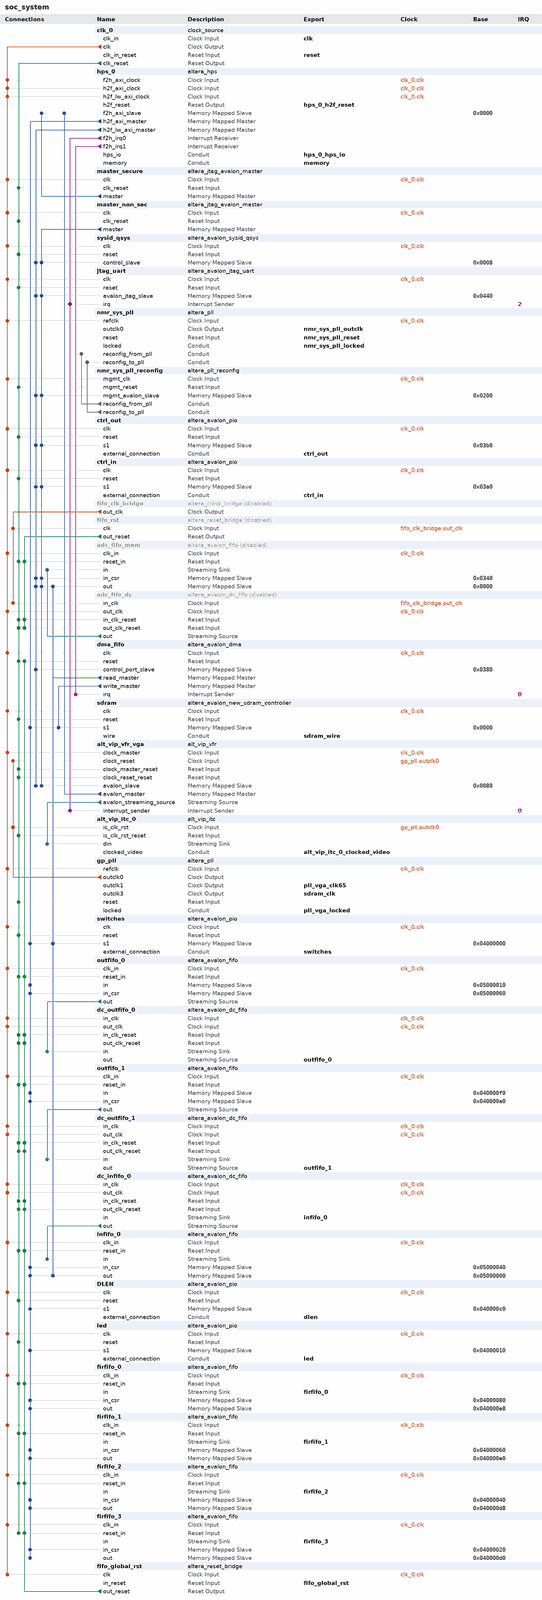
[diagram p0: system contents, whole]
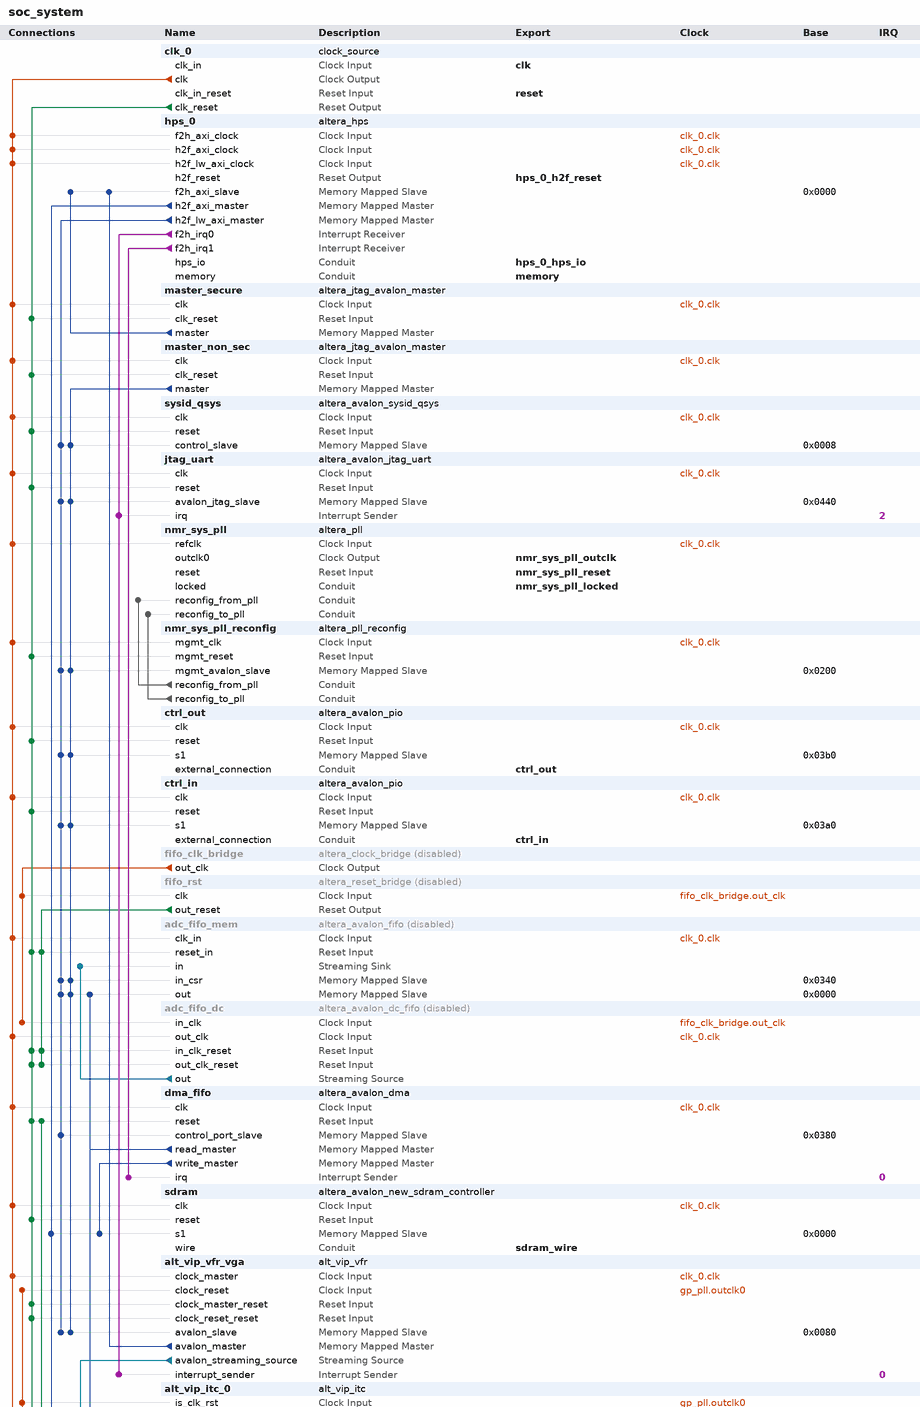
[diagram p1: system contents, upper part]
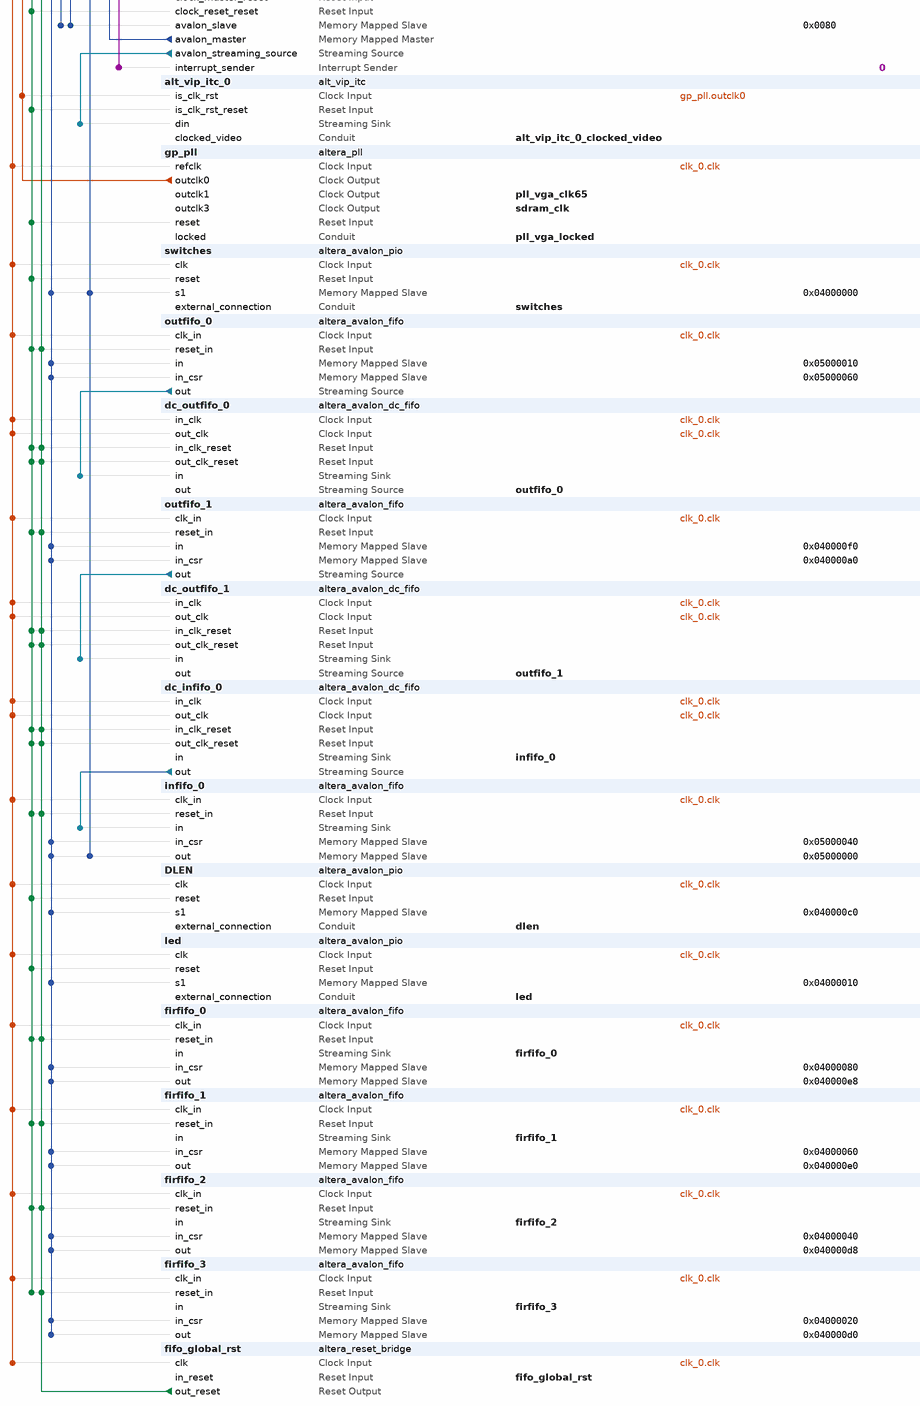
[diagram p2: system contents, lower part]
# Platform Designer (Qsys) system soc_system, Cyclone V 5CSEMA5F31C6
# Parameters at their usual value, and those the tool derives, are not listed.
package require -exact qsys 17.1
create_system soc_system
set_project_property DEVICE_FAMILY {Cyclone V}
set_project_property DEVICE 5CSEMA5F31C6

add_instance clk_0 clock_source 17.1
set_instance_parameter_value clk_0 clockFrequency 50000000

add_instance hps_0 altera_hps 17.1
set_instance_parameter_value hps_0 EMAC1_Mode RGMII
set_instance_parameter_value hps_0 EMAC1_PinMuxing {HPS I/O Set 0}
set_instance_parameter_value hps_0 F2SCLK_COLDRST_Enable false
set_instance_parameter_value hps_0 F2SCLK_DBGRST_Enable false
set_instance_parameter_value hps_0 F2SCLK_WARMRST_Enable false
set_instance_parameter_value hps_0 F2SINTERRUPT_Enable true
set_instance_parameter_value hps_0 F2S_Width 3
set_instance_parameter_value hps_0 FPGA_PERIPHERAL_OUTPUT_CLOCK_FREQ_EMAC0_GTX_CLK 100
set_instance_parameter_value hps_0 FPGA_PERIPHERAL_OUTPUT_CLOCK_FREQ_EMAC0_MD_CLK 100.0
set_instance_parameter_value hps_0 FPGA_PERIPHERAL_OUTPUT_CLOCK_FREQ_EMAC1_GTX_CLK 100
set_instance_parameter_value hps_0 FPGA_PERIPHERAL_OUTPUT_CLOCK_FREQ_EMAC1_MD_CLK 100.0
set_instance_parameter_value hps_0 HPS_PROTOCOL DDR3
set_instance_parameter_value hps_0 I2C0_Mode I2C
set_instance_parameter_value hps_0 I2C0_PinMuxing {HPS I/O Set 0}
set_instance_parameter_value hps_0 I2C1_Mode I2C
set_instance_parameter_value hps_0 I2C1_PinMuxing {HPS I/O Set 0}
set_instance_parameter_value hps_0 LWH2F_Enable true
set_instance_parameter_value hps_0 MEM_BANKADDR_WIDTH 3
set_instance_parameter_value hps_0 MEM_CLK_FREQ 400.0
set_instance_parameter_value hps_0 MEM_COL_ADDR_WIDTH 10
set_instance_parameter_value hps_0 MEM_DQ_WIDTH 32
set_instance_parameter_value hps_0 MEM_DRV_STR RZQ/7
set_instance_parameter_value hps_0 MEM_ROW_ADDR_WIDTH 15
set_instance_parameter_value hps_0 MEM_RTT_NOM RZQ/4
set_instance_parameter_value hps_0 MEM_RTT_WR RZQ/4
set_instance_parameter_value hps_0 MEM_TCL 11
set_instance_parameter_value hps_0 MEM_TFAW_NS 30.0
set_instance_parameter_value hps_0 MEM_TRAS_NS 35.0
set_instance_parameter_value hps_0 MEM_TRCD_NS 13.75
set_instance_parameter_value hps_0 MEM_TRFC_NS 260.0
set_instance_parameter_value hps_0 MEM_TRP_NS 13.75
set_instance_parameter_value hps_0 MEM_VENDOR JEDEC
set_instance_parameter_value hps_0 MEM_WTCL 8
set_instance_parameter_value hps_0 QSPI_Mode {1 SS}
set_instance_parameter_value hps_0 QSPI_PinMuxing {HPS I/O Set 0}
set_instance_parameter_value hps_0 REF_CLK_FREQ 25.0
set_instance_parameter_value hps_0 S2FCLK_USER2CLK 5
set_instance_parameter_value hps_0 S2F_Width 3
set_instance_parameter_value hps_0 SDIO_Mode {4-bit Data}
set_instance_parameter_value hps_0 SDIO_PinMuxing {HPS I/O Set 0}
set_instance_parameter_value hps_0 SPIM1_Mode {Single Slave Select}
set_instance_parameter_value hps_0 SPIM1_PinMuxing {HPS I/O Set 0}
set_instance_parameter_value hps_0 STM_Enable false
set_instance_parameter_value hps_0 TIMING_BOARD_AC_SKEW 0.03
set_instance_parameter_value hps_0 TIMING_BOARD_AC_TO_CK_SKEW 0.0
set_instance_parameter_value hps_0 TIMING_BOARD_DQ_TO_DQS_SKEW 0.0
set_instance_parameter_value hps_0 TIMING_BOARD_MAX_CK_DELAY 0.03
set_instance_parameter_value hps_0 TIMING_BOARD_MAX_DQS_DELAY 0.02
set_instance_parameter_value hps_0 TIMING_BOARD_SKEW_BETWEEN_DQS 0.08
set_instance_parameter_value hps_0 TIMING_BOARD_SKEW_CKDQS_DIMM_MAX 0.16
set_instance_parameter_value hps_0 TIMING_BOARD_SKEW_CKDQS_DIMM_MIN 0.09
set_instance_parameter_value hps_0 TIMING_BOARD_SKEW_WITHIN_DQS 0.01
set_instance_parameter_value hps_0 TIMING_TDH 65
set_instance_parameter_value hps_0 TIMING_TDQSCK 255
set_instance_parameter_value hps_0 TIMING_TDQSQ 125
set_instance_parameter_value hps_0 TIMING_TDS 30
set_instance_parameter_value hps_0 TIMING_TIH 140
set_instance_parameter_value hps_0 TIMING_TIS 180
set_instance_parameter_value hps_0 TIMING_TQSH 0.4
set_instance_parameter_value hps_0 UART0_Mode {No Flow Control}
set_instance_parameter_value hps_0 UART0_PinMuxing {HPS I/O Set 0}
set_instance_parameter_value hps_0 USB1_Mode SDR
set_instance_parameter_value hps_0 USB1_PinMuxing {HPS I/O Set 0}
set_instance_parameter_value hps_0 desired_cfg_clk_mhz 97.368421
set_instance_parameter_value hps_0 desired_qspi_clk_mhz 370.0

add_instance master_secure altera_jtag_avalon_master 17.1

add_instance master_non_sec altera_jtag_avalon_master 17.1

add_instance sysid_qsys altera_avalon_sysid_qsys 17.1
set_instance_parameter_value sysid_qsys id -1395322110

add_instance jtag_uart altera_avalon_jtag_uart 17.1
set_instance_parameter_value jtag_uart allowMultipleConnections true
set_instance_parameter_value jtag_uart simInteractiveOptions INTERACTIVE_ASCII_OUTPUT

add_instance nmr_sys_pll altera_pll 17.1
set_instance_parameter_value nmr_sys_pll gui_device_speed_grade 2
set_instance_parameter_value nmr_sys_pll gui_en_reconf true
set_instance_parameter_value nmr_sys_pll gui_number_of_clocks 1
set_instance_parameter_value nmr_sys_pll gui_operation_mode direct
set_instance_parameter_value nmr_sys_pll gui_output_clock_frequency0 120.0
set_instance_parameter_value nmr_sys_pll gui_pll_mode {Fractional-N PLL}
set_instance_parameter_value nmr_sys_pll gui_reference_clock_frequency 50.0
set_instance_parameter_value nmr_sys_pll gui_use_locked true

add_instance nmr_sys_pll_reconfig altera_pll_reconfig 17.1

add_instance ctrl_out altera_avalon_pio 17.1
set_instance_parameter_value ctrl_out direction Output
set_instance_parameter_value ctrl_out resetValue 119
set_instance_parameter_value ctrl_out width 32

add_instance ctrl_in altera_avalon_pio 17.1
set_instance_parameter_value ctrl_in direction Input
set_instance_parameter_value ctrl_in width 8

add_instance fifo_clk_bridge altera_clock_bridge 17.1
set_instance_property fifo_clk_bridge ENABLED false
set_instance_parameter_value fifo_clk_bridge DERIVED_CLOCK_RATE 0
set_instance_parameter_value fifo_clk_bridge EXPLICIT_CLOCK_RATE 0

add_instance fifo_rst altera_reset_bridge 17.1
set_instance_property fifo_rst ENABLED false
set_instance_parameter_value fifo_rst ACTIVE_LOW_RESET 0
set_instance_parameter_value fifo_rst SYNCHRONOUS_EDGES deassert

add_instance adc_fifo_mem altera_avalon_fifo 17.1
set_instance_property adc_fifo_mem ENABLED false
set_instance_parameter_value adc_fifo_mem bitsPerSymbol 32
set_instance_parameter_value adc_fifo_mem channelWidth 0
set_instance_parameter_value adc_fifo_mem errorWidth 0
set_instance_parameter_value adc_fifo_mem fifoDepth 1024
set_instance_parameter_value adc_fifo_mem fifoInputInterfaceOptions AVALONST_SINK
set_instance_parameter_value adc_fifo_mem fifoOutputInterfaceOptions AVALONMM_READ
set_instance_parameter_value adc_fifo_mem singleClockMode true
set_instance_parameter_value adc_fifo_mem symbolsPerBeat 1
set_instance_parameter_value adc_fifo_mem useIRQ false
set_instance_parameter_value adc_fifo_mem usePacket false
set_instance_parameter_value adc_fifo_mem useReadControl false

add_instance adc_fifo_dc altera_avalon_dc_fifo 17.1
set_instance_property adc_fifo_dc ENABLED false
set_instance_parameter_value adc_fifo_dc BITS_PER_SYMBOL 32
set_instance_parameter_value adc_fifo_dc FIFO_DEPTH 16384
set_instance_parameter_value adc_fifo_dc USE_PACKETS 0

add_instance dma_fifo altera_avalon_dma 17.1
set_instance_parameter_value dma_fifo allowByteTransactions false
set_instance_parameter_value dma_fifo allowDoubleWordTransactions false
set_instance_parameter_value dma_fifo allowHalfWordTransactions false
set_instance_parameter_value dma_fifo allowQuadWordTransactions false
set_instance_parameter_value dma_fifo burstEnable false
set_instance_parameter_value dma_fifo fifoDepth 1024
set_instance_parameter_value dma_fifo maxBurstSize 1024
set_instance_parameter_value dma_fifo minimumDmaTransactionRegisterWidth 32

add_instance sdram altera_avalon_new_sdram_controller 17.1
set_instance_parameter_value sdram TAC 5.4
set_instance_parameter_value sdram TRCD 15.0
set_instance_parameter_value sdram TRP 15.0
set_instance_parameter_value sdram casLatency 3
set_instance_parameter_value sdram columnWidth 10
set_instance_parameter_value sdram dataWidth 16
set_instance_parameter_value sdram generateSimulationModel true
set_instance_parameter_value sdram model single_Micron_MT48LC4M32B2_7_chip
set_instance_parameter_value sdram numberOfBanks 4
set_instance_parameter_value sdram numberOfChipSelects 1
set_instance_parameter_value sdram powerUpDelay 100.0
set_instance_parameter_value sdram refreshPeriod 7.8125
set_instance_parameter_value sdram rowWidth 13

add_instance alt_vip_vfr_vga alt_vip_vfr 14.0
set_instance_parameter_value alt_vip_vfr_vga MAX_IMAGE_WIDTH 1024

add_instance alt_vip_itc_0 alt_vip_itc 14.0
set_instance_parameter_value alt_vip_itc_0 FIFO_DEPTH 1920
set_instance_parameter_value alt_vip_itc_0 H_ACTIVE_PIXELS 1024
set_instance_parameter_value alt_vip_itc_0 H_BACK_PORCH 160
set_instance_parameter_value alt_vip_itc_0 H_FRONT_PORCH 24
set_instance_parameter_value alt_vip_itc_0 H_SYNC_LENGTH 136
set_instance_parameter_value alt_vip_itc_0 NUMBER_OF_COLOUR_PLANES 4
set_instance_parameter_value alt_vip_itc_0 THRESHOLD 1919
set_instance_parameter_value alt_vip_itc_0 V_ACTIVE_LINES 768
set_instance_parameter_value alt_vip_itc_0 V_BACK_PORCH 29
set_instance_parameter_value alt_vip_itc_0 V_FRONT_PORCH 3
set_instance_parameter_value alt_vip_itc_0 V_SYNC_LENGTH 6

add_instance gp_pll altera_pll 17.1
set_instance_parameter_value gp_pll gui_device_speed_grade 2
set_instance_parameter_value gp_pll gui_number_of_clocks 4
set_instance_parameter_value gp_pll gui_operation_mode normal
set_instance_parameter_value gp_pll gui_output_clock_frequency0 130.0
set_instance_parameter_value gp_pll gui_output_clock_frequency1 65.0
set_instance_parameter_value gp_pll gui_output_clock_frequency2 50.0
set_instance_parameter_value gp_pll gui_output_clock_frequency3 50.0
set_instance_parameter_value gp_pll gui_phase_shift3 -3800
set_instance_parameter_value gp_pll gui_pll_mode {Integer-N PLL}
set_instance_parameter_value gp_pll gui_reference_clock_frequency 50.0
set_instance_parameter_value gp_pll gui_use_locked true

add_instance switches altera_avalon_pio 17.1
set_instance_parameter_value switches direction Input
set_instance_parameter_value switches simDoTestBenchWiring true
set_instance_parameter_value switches width 10

add_instance outfifo_0 altera_avalon_fifo 17.1
set_instance_parameter_value outfifo_0 avalonMMAvalonMMDataWidth 64
set_instance_parameter_value outfifo_0 bitsPerSymbol 32
set_instance_parameter_value outfifo_0 channelWidth 0
set_instance_parameter_value outfifo_0 errorWidth 0
set_instance_parameter_value outfifo_0 fifoDepth 4096
set_instance_parameter_value outfifo_0 fifoInputInterfaceOptions AVALONMM_WRITE
set_instance_parameter_value outfifo_0 fifoOutputInterfaceOptions AVALONST_SOURCE
set_instance_parameter_value outfifo_0 singleClockMode true
set_instance_parameter_value outfifo_0 symbolsPerBeat 1
set_instance_parameter_value outfifo_0 useIRQ false
set_instance_parameter_value outfifo_0 usePacket false
set_instance_parameter_value outfifo_0 useReadControl false

add_instance dc_outfifo_0 altera_avalon_dc_fifo 17.1
set_instance_parameter_value dc_outfifo_0 BITS_PER_SYMBOL 32
set_instance_parameter_value dc_outfifo_0 FIFO_DEPTH 16384
set_instance_parameter_value dc_outfifo_0 USE_PACKETS 0

add_instance outfifo_1 altera_avalon_fifo 17.1
set_instance_parameter_value outfifo_1 avalonMMAvalonMMDataWidth 64
set_instance_parameter_value outfifo_1 bitsPerSymbol 32
set_instance_parameter_value outfifo_1 channelWidth 0
set_instance_parameter_value outfifo_1 errorWidth 0
set_instance_parameter_value outfifo_1 fifoDepth 4096
set_instance_parameter_value outfifo_1 fifoInputInterfaceOptions AVALONMM_WRITE
set_instance_parameter_value outfifo_1 fifoOutputInterfaceOptions AVALONST_SOURCE
set_instance_parameter_value outfifo_1 singleClockMode true
set_instance_parameter_value outfifo_1 symbolsPerBeat 1
set_instance_parameter_value outfifo_1 useIRQ false
set_instance_parameter_value outfifo_1 usePacket false
set_instance_parameter_value outfifo_1 useReadControl false

add_instance dc_outfifo_1 altera_avalon_dc_fifo 17.1
set_instance_parameter_value dc_outfifo_1 BITS_PER_SYMBOL 32
set_instance_parameter_value dc_outfifo_1 FIFO_DEPTH 16384
set_instance_parameter_value dc_outfifo_1 USE_PACKETS 0

add_instance dc_infifo_0 altera_avalon_dc_fifo 17.1
set_instance_parameter_value dc_infifo_0 BITS_PER_SYMBOL 32
set_instance_parameter_value dc_infifo_0 FIFO_DEPTH 16384
set_instance_parameter_value dc_infifo_0 USE_PACKETS 0

add_instance infifo_0 altera_avalon_fifo 17.1
set_instance_parameter_value infifo_0 avalonMMAvalonMMDataWidth 64
set_instance_parameter_value infifo_0 bitsPerSymbol 32
set_instance_parameter_value infifo_0 channelWidth 0
set_instance_parameter_value infifo_0 errorWidth 0
set_instance_parameter_value infifo_0 fifoDepth 8192
set_instance_parameter_value infifo_0 fifoInputInterfaceOptions AVALONST_SINK
set_instance_parameter_value infifo_0 fifoOutputInterfaceOptions AVALONMM_READ
set_instance_parameter_value infifo_0 singleClockMode true
set_instance_parameter_value infifo_0 symbolsPerBeat 1
set_instance_parameter_value infifo_0 useIRQ false
set_instance_parameter_value infifo_0 usePacket false
set_instance_parameter_value infifo_0 useReadControl false

add_instance DLEN altera_avalon_pio 17.1
set_instance_parameter_value DLEN direction Output
set_instance_parameter_value DLEN width 32

add_instance led altera_avalon_pio 17.1
set_instance_parameter_value led direction Output
set_instance_parameter_value led simDoTestBenchWiring true
set_instance_parameter_value led width 10

add_instance firfifo_0 altera_avalon_fifo 17.1
set_instance_parameter_value firfifo_0 avalonMMAvalonMMDataWidth 64
set_instance_parameter_value firfifo_0 bitsPerSymbol 32
set_instance_parameter_value firfifo_0 channelWidth 0
set_instance_parameter_value firfifo_0 errorWidth 0
set_instance_parameter_value firfifo_0 fifoDepth 8192
set_instance_parameter_value firfifo_0 fifoInputInterfaceOptions AVALONST_SINK
set_instance_parameter_value firfifo_0 fifoOutputInterfaceOptions AVALONMM_READ
set_instance_parameter_value firfifo_0 singleClockMode true
set_instance_parameter_value firfifo_0 symbolsPerBeat 1
set_instance_parameter_value firfifo_0 useBackpressure false
set_instance_parameter_value firfifo_0 useIRQ false
set_instance_parameter_value firfifo_0 usePacket false
set_instance_parameter_value firfifo_0 useReadControl false

add_instance firfifo_1 altera_avalon_fifo 17.1
set_instance_parameter_value firfifo_1 avalonMMAvalonMMDataWidth 64
set_instance_parameter_value firfifo_1 bitsPerSymbol 32
set_instance_parameter_value firfifo_1 channelWidth 0
set_instance_parameter_value firfifo_1 errorWidth 0
set_instance_parameter_value firfifo_1 fifoDepth 8192
set_instance_parameter_value firfifo_1 fifoInputInterfaceOptions AVALONST_SINK
set_instance_parameter_value firfifo_1 fifoOutputInterfaceOptions AVALONMM_READ
set_instance_parameter_value firfifo_1 singleClockMode true
set_instance_parameter_value firfifo_1 symbolsPerBeat 1
set_instance_parameter_value firfifo_1 useBackpressure false
set_instance_parameter_value firfifo_1 useIRQ false
set_instance_parameter_value firfifo_1 usePacket false
set_instance_parameter_value firfifo_1 useReadControl false

add_instance firfifo_2 altera_avalon_fifo 17.1
set_instance_parameter_value firfifo_2 avalonMMAvalonMMDataWidth 64
set_instance_parameter_value firfifo_2 bitsPerSymbol 32
set_instance_parameter_value firfifo_2 channelWidth 0
set_instance_parameter_value firfifo_2 errorWidth 0
set_instance_parameter_value firfifo_2 fifoDepth 8192
set_instance_parameter_value firfifo_2 fifoInputInterfaceOptions AVALONST_SINK
set_instance_parameter_value firfifo_2 fifoOutputInterfaceOptions AVALONMM_READ
set_instance_parameter_value firfifo_2 singleClockMode true
set_instance_parameter_value firfifo_2 symbolsPerBeat 1
set_instance_parameter_value firfifo_2 useBackpressure false
set_instance_parameter_value firfifo_2 useIRQ false
set_instance_parameter_value firfifo_2 usePacket false
set_instance_parameter_value firfifo_2 useReadControl false

add_instance firfifo_3 altera_avalon_fifo 17.1
set_instance_parameter_value firfifo_3 avalonMMAvalonMMDataWidth 64
set_instance_parameter_value firfifo_3 bitsPerSymbol 32
set_instance_parameter_value firfifo_3 channelWidth 0
set_instance_parameter_value firfifo_3 errorWidth 0
set_instance_parameter_value firfifo_3 fifoDepth 8192
set_instance_parameter_value firfifo_3 fifoInputInterfaceOptions AVALONST_SINK
set_instance_parameter_value firfifo_3 fifoOutputInterfaceOptions AVALONMM_READ
set_instance_parameter_value firfifo_3 singleClockMode true
set_instance_parameter_value firfifo_3 symbolsPerBeat 1
set_instance_parameter_value firfifo_3 useBackpressure false
set_instance_parameter_value firfifo_3 useIRQ false
set_instance_parameter_value firfifo_3 usePacket false
set_instance_parameter_value firfifo_3 useReadControl false

add_instance fifo_global_rst altera_reset_bridge 17.1
set_instance_parameter_value fifo_global_rst ACTIVE_LOW_RESET 0
set_instance_parameter_value fifo_global_rst SYNCHRONOUS_EDGES deassert

# connections
add_connection clk_0.clk adc_fifo_dc.out_clk clock
add_connection clk_0.clk adc_fifo_mem.clk_in clock
add_connection clk_0.clk alt_vip_vfr_vga.clock_master clock
add_connection clk_0.clk ctrl_in.clk clock
add_connection clk_0.clk ctrl_out.clk clock
add_connection clk_0.clk dc_infifo_0.in_clk clock
add_connection clk_0.clk dc_infifo_0.out_clk clock
add_connection clk_0.clk dc_outfifo_0.in_clk clock
add_connection clk_0.clk dc_outfifo_0.out_clk clock
add_connection clk_0.clk dc_outfifo_1.in_clk clock
add_connection clk_0.clk dc_outfifo_1.out_clk clock
add_connection clk_0.clk DLEN.clk clock
add_connection clk_0.clk dma_fifo.clk clock
add_connection clk_0.clk fifo_global_rst.clk clock
add_connection clk_0.clk firfifo_0.clk_in clock
add_connection clk_0.clk firfifo_1.clk_in clock
add_connection clk_0.clk firfifo_2.clk_in clock
add_connection clk_0.clk firfifo_3.clk_in clock
add_connection clk_0.clk gp_pll.refclk clock
add_connection clk_0.clk hps_0.f2h_axi_clock clock
add_connection clk_0.clk hps_0.h2f_axi_clock clock
add_connection clk_0.clk hps_0.h2f_lw_axi_clock clock
add_connection clk_0.clk infifo_0.clk_in clock
add_connection clk_0.clk jtag_uart.clk clock
add_connection clk_0.clk led.clk clock
add_connection clk_0.clk master_non_sec.clk clock
add_connection clk_0.clk master_secure.clk clock
add_connection clk_0.clk nmr_sys_pll.refclk clock
add_connection clk_0.clk nmr_sys_pll_reconfig.mgmt_clk clock
add_connection clk_0.clk outfifo_0.clk_in clock
add_connection clk_0.clk outfifo_1.clk_in clock
add_connection clk_0.clk sdram.clk clock
add_connection clk_0.clk switches.clk clock
add_connection clk_0.clk sysid_qsys.clk clock
add_connection fifo_clk_bridge.out_clk adc_fifo_dc.in_clk clock
add_connection fifo_clk_bridge.out_clk fifo_rst.clk clock
add_connection gp_pll.outclk0 alt_vip_itc_0.is_clk_rst clock
add_connection gp_pll.outclk0 alt_vip_vfr_vga.clock_reset clock
add_connection clk_0.clk_reset adc_fifo_dc.in_clk_reset reset
add_connection clk_0.clk_reset adc_fifo_dc.out_clk_reset reset
add_connection clk_0.clk_reset adc_fifo_mem.reset_in reset
add_connection clk_0.clk_reset alt_vip_itc_0.is_clk_rst_reset reset
add_connection clk_0.clk_reset alt_vip_vfr_vga.clock_master_reset reset
add_connection clk_0.clk_reset alt_vip_vfr_vga.clock_reset_reset reset
add_connection clk_0.clk_reset ctrl_in.reset reset
add_connection clk_0.clk_reset ctrl_out.reset reset
add_connection clk_0.clk_reset dc_infifo_0.in_clk_reset reset
add_connection clk_0.clk_reset dc_infifo_0.out_clk_reset reset
add_connection clk_0.clk_reset dc_outfifo_0.in_clk_reset reset
add_connection clk_0.clk_reset dc_outfifo_0.out_clk_reset reset
add_connection clk_0.clk_reset dc_outfifo_1.in_clk_reset reset
add_connection clk_0.clk_reset dc_outfifo_1.out_clk_reset reset
add_connection clk_0.clk_reset DLEN.reset reset
add_connection clk_0.clk_reset dma_fifo.reset reset
add_connection clk_0.clk_reset firfifo_0.reset_in reset
add_connection clk_0.clk_reset firfifo_1.reset_in reset
add_connection clk_0.clk_reset firfifo_2.reset_in reset
add_connection clk_0.clk_reset firfifo_3.reset_in reset
add_connection clk_0.clk_reset gp_pll.reset reset
add_connection clk_0.clk_reset infifo_0.reset_in reset
add_connection clk_0.clk_reset jtag_uart.reset reset
add_connection clk_0.clk_reset led.reset reset
add_connection clk_0.clk_reset master_non_sec.clk_reset reset
add_connection clk_0.clk_reset master_secure.clk_reset reset
add_connection clk_0.clk_reset nmr_sys_pll_reconfig.mgmt_reset reset
add_connection clk_0.clk_reset outfifo_0.reset_in reset
add_connection clk_0.clk_reset outfifo_1.reset_in reset
add_connection clk_0.clk_reset sdram.reset reset
add_connection clk_0.clk_reset switches.reset reset
add_connection clk_0.clk_reset sysid_qsys.reset reset
add_connection fifo_global_rst.out_reset dc_infifo_0.in_clk_reset reset
add_connection fifo_global_rst.out_reset dc_infifo_0.out_clk_reset reset
add_connection fifo_global_rst.out_reset dc_outfifo_0.in_clk_reset reset
add_connection fifo_global_rst.out_reset dc_outfifo_0.out_clk_reset reset
add_connection fifo_global_rst.out_reset dc_outfifo_1.in_clk_reset reset
add_connection fifo_global_rst.out_reset dc_outfifo_1.out_clk_reset reset
add_connection fifo_global_rst.out_reset dma_fifo.reset reset
add_connection fifo_global_rst.out_reset firfifo_0.reset_in reset
add_connection fifo_global_rst.out_reset firfifo_1.reset_in reset
add_connection fifo_global_rst.out_reset firfifo_2.reset_in reset
add_connection fifo_global_rst.out_reset firfifo_3.reset_in reset
add_connection fifo_global_rst.out_reset infifo_0.reset_in reset
add_connection fifo_global_rst.out_reset outfifo_0.reset_in reset
add_connection fifo_global_rst.out_reset outfifo_1.reset_in reset
add_connection fifo_rst.out_reset adc_fifo_dc.in_clk_reset reset
add_connection fifo_rst.out_reset adc_fifo_dc.out_clk_reset reset
add_connection fifo_rst.out_reset adc_fifo_mem.reset_in reset
add_connection alt_vip_vfr_vga.avalon_master hps_0.f2h_axi_slave avalon
set_connection_parameter_value alt_vip_vfr_vga.avalon_master/hps_0.f2h_axi_slave baseAddress 0x0000
add_connection dma_fifo.read_master adc_fifo_mem.out avalon
set_connection_parameter_value dma_fifo.read_master/adc_fifo_mem.out baseAddress 0x0000
add_connection dma_fifo.read_master infifo_0.out avalon
set_connection_parameter_value dma_fifo.read_master/infifo_0.out baseAddress 0x05000000
add_connection dma_fifo.read_master switches.s1 avalon
set_connection_parameter_value dma_fifo.read_master/switches.s1 baseAddress 0x04000000
add_connection dma_fifo.write_master sdram.s1 avalon
set_connection_parameter_value dma_fifo.write_master/sdram.s1 baseAddress 0x0000
add_connection hps_0.h2f_axi_master DLEN.s1 avalon
set_connection_parameter_value hps_0.h2f_axi_master/DLEN.s1 baseAddress 0x040000c0
add_connection hps_0.h2f_axi_master firfifo_0.in_csr avalon
set_connection_parameter_value hps_0.h2f_axi_master/firfifo_0.in_csr baseAddress 0x04000080
add_connection hps_0.h2f_axi_master firfifo_0.out avalon
set_connection_parameter_value hps_0.h2f_axi_master/firfifo_0.out baseAddress 0x040000e8
add_connection hps_0.h2f_axi_master firfifo_1.in_csr avalon
set_connection_parameter_value hps_0.h2f_axi_master/firfifo_1.in_csr baseAddress 0x04000060
add_connection hps_0.h2f_axi_master firfifo_1.out avalon
set_connection_parameter_value hps_0.h2f_axi_master/firfifo_1.out baseAddress 0x040000e0
add_connection hps_0.h2f_axi_master firfifo_2.in_csr avalon
set_connection_parameter_value hps_0.h2f_axi_master/firfifo_2.in_csr baseAddress 0x04000040
add_connection hps_0.h2f_axi_master firfifo_2.out avalon
set_connection_parameter_value hps_0.h2f_axi_master/firfifo_2.out baseAddress 0x040000d8
add_connection hps_0.h2f_axi_master firfifo_3.in_csr avalon
set_connection_parameter_value hps_0.h2f_axi_master/firfifo_3.in_csr baseAddress 0x04000020
add_connection hps_0.h2f_axi_master firfifo_3.out avalon
set_connection_parameter_value hps_0.h2f_axi_master/firfifo_3.out baseAddress 0x040000d0
add_connection hps_0.h2f_axi_master infifo_0.in_csr avalon
set_connection_parameter_value hps_0.h2f_axi_master/infifo_0.in_csr baseAddress 0x05000040
add_connection hps_0.h2f_axi_master infifo_0.out avalon
set_connection_parameter_value hps_0.h2f_axi_master/infifo_0.out baseAddress 0x05000000
add_connection hps_0.h2f_axi_master led.s1 avalon
set_connection_parameter_value hps_0.h2f_axi_master/led.s1 baseAddress 0x04000010
add_connection hps_0.h2f_axi_master outfifo_0.in avalon
set_connection_parameter_value hps_0.h2f_axi_master/outfifo_0.in baseAddress 0x05000010
add_connection hps_0.h2f_axi_master outfifo_0.in_csr avalon
set_connection_parameter_value hps_0.h2f_axi_master/outfifo_0.in_csr baseAddress 0x05000060
add_connection hps_0.h2f_axi_master outfifo_1.in avalon
set_connection_parameter_value hps_0.h2f_axi_master/outfifo_1.in baseAddress 0x040000f0
add_connection hps_0.h2f_axi_master outfifo_1.in_csr avalon
set_connection_parameter_value hps_0.h2f_axi_master/outfifo_1.in_csr baseAddress 0x040000a0
add_connection hps_0.h2f_axi_master sdram.s1 avalon
set_connection_parameter_value hps_0.h2f_axi_master/sdram.s1 baseAddress 0x0000
add_connection hps_0.h2f_axi_master switches.s1 avalon
set_connection_parameter_value hps_0.h2f_axi_master/switches.s1 baseAddress 0x04000000
add_connection hps_0.h2f_lw_axi_master adc_fifo_mem.in_csr avalon
set_connection_parameter_value hps_0.h2f_lw_axi_master/adc_fifo_mem.in_csr baseAddress 0x0340
add_connection hps_0.h2f_lw_axi_master adc_fifo_mem.out avalon
set_connection_parameter_value hps_0.h2f_lw_axi_master/adc_fifo_mem.out baseAddress 0x0000
add_connection hps_0.h2f_lw_axi_master alt_vip_vfr_vga.avalon_slave avalon
set_connection_parameter_value hps_0.h2f_lw_axi_master/alt_vip_vfr_vga.avalon_slave baseAddress 0x0080
add_connection hps_0.h2f_lw_axi_master ctrl_in.s1 avalon
set_connection_parameter_value hps_0.h2f_lw_axi_master/ctrl_in.s1 baseAddress 0x03a0
add_connection hps_0.h2f_lw_axi_master ctrl_out.s1 avalon
set_connection_parameter_value hps_0.h2f_lw_axi_master/ctrl_out.s1 baseAddress 0x03b0
add_connection hps_0.h2f_lw_axi_master dma_fifo.control_port_slave avalon
set_connection_parameter_value hps_0.h2f_lw_axi_master/dma_fifo.control_port_slave baseAddress 0x0380
add_connection hps_0.h2f_lw_axi_master jtag_uart.avalon_jtag_slave avalon
set_connection_parameter_value hps_0.h2f_lw_axi_master/jtag_uart.avalon_jtag_slave baseAddress 0x0440
add_connection hps_0.h2f_lw_axi_master nmr_sys_pll_reconfig.mgmt_avalon_slave avalon
set_connection_parameter_value hps_0.h2f_lw_axi_master/nmr_sys_pll_reconfig.mgmt_avalon_slave baseAddress 0x0200
add_connection hps_0.h2f_lw_axi_master sysid_qsys.control_slave avalon
set_connection_parameter_value hps_0.h2f_lw_axi_master/sysid_qsys.control_slave baseAddress 0x0008
add_connection master_non_sec.master adc_fifo_mem.in_csr avalon
set_connection_parameter_value master_non_sec.master/adc_fifo_mem.in_csr baseAddress 0x0340
add_connection master_non_sec.master adc_fifo_mem.out avalon
set_connection_parameter_value master_non_sec.master/adc_fifo_mem.out baseAddress 0x0000
add_connection master_non_sec.master alt_vip_vfr_vga.avalon_slave avalon
set_connection_parameter_value master_non_sec.master/alt_vip_vfr_vga.avalon_slave baseAddress 0x0080
add_connection master_non_sec.master ctrl_in.s1 avalon
set_connection_parameter_value master_non_sec.master/ctrl_in.s1 baseAddress 0x03a0
add_connection master_non_sec.master ctrl_out.s1 avalon
set_connection_parameter_value master_non_sec.master/ctrl_out.s1 baseAddress 0x03b0
add_connection master_non_sec.master jtag_uart.avalon_jtag_slave avalon
set_connection_parameter_value master_non_sec.master/jtag_uart.avalon_jtag_slave baseAddress 0x0440
add_connection master_non_sec.master nmr_sys_pll_reconfig.mgmt_avalon_slave avalon
set_connection_parameter_value master_non_sec.master/nmr_sys_pll_reconfig.mgmt_avalon_slave baseAddress 0x0200
add_connection master_non_sec.master sysid_qsys.control_slave avalon
set_connection_parameter_value master_non_sec.master/sysid_qsys.control_slave baseAddress 0x0008
add_connection master_secure.master hps_0.f2h_axi_slave avalon
set_connection_parameter_value master_secure.master/hps_0.f2h_axi_slave baseAddress 0x0000
add_connection adc_fifo_dc.out adc_fifo_mem.in avalon_streaming
add_connection alt_vip_vfr_vga.avalon_streaming_source alt_vip_itc_0.din avalon_streaming
add_connection dc_infifo_0.out infifo_0.in avalon_streaming
add_connection outfifo_0.out dc_outfifo_0.in avalon_streaming
add_connection outfifo_1.out dc_outfifo_1.in avalon_streaming
add_connection nmr_sys_pll_reconfig.reconfig_from_pll nmr_sys_pll.reconfig_from_pll conduit
add_connection nmr_sys_pll_reconfig.reconfig_to_pll nmr_sys_pll.reconfig_to_pll conduit
add_connection hps_0.f2h_irq0 alt_vip_vfr_vga.interrupt_sender interrupt
set_connection_parameter_value hps_0.f2h_irq0/alt_vip_vfr_vga.interrupt_sender irqNumber 0
add_connection hps_0.f2h_irq0 jtag_uart.irq interrupt
set_connection_parameter_value hps_0.f2h_irq0/jtag_uart.irq irqNumber 2
add_connection hps_0.f2h_irq1 dma_fifo.irq interrupt
set_connection_parameter_value hps_0.f2h_irq1/dma_fifo.irq irqNumber 0

# exported interfaces
add_interface alt_vip_itc_0_clocked_video conduit end
set_interface_property alt_vip_itc_0_clocked_video EXPORT_OF alt_vip_itc_0.clocked_video
add_interface clk clock sink
set_interface_property clk EXPORT_OF clk_0.clk_in
add_interface ctrl_in conduit end
set_interface_property ctrl_in EXPORT_OF ctrl_in.external_connection
add_interface ctrl_out conduit end
set_interface_property ctrl_out EXPORT_OF ctrl_out.external_connection
add_interface dlen conduit end
set_interface_property dlen EXPORT_OF DLEN.external_connection
add_interface fifo_global_rst reset sink
set_interface_property fifo_global_rst EXPORT_OF fifo_global_rst.in_reset
add_interface firfifo_0 avalon_streaming sink
set_interface_property firfifo_0 EXPORT_OF firfifo_0.in
add_interface firfifo_1 avalon_streaming sink
set_interface_property firfifo_1 EXPORT_OF firfifo_1.in
add_interface firfifo_2 avalon_streaming sink
set_interface_property firfifo_2 EXPORT_OF firfifo_2.in
add_interface firfifo_3 avalon_streaming sink
set_interface_property firfifo_3 EXPORT_OF firfifo_3.in
add_interface hps_0_h2f_reset reset source
set_interface_property hps_0_h2f_reset EXPORT_OF hps_0.h2f_reset
add_interface hps_0_hps_io conduit end
set_interface_property hps_0_hps_io EXPORT_OF hps_0.hps_io
add_interface infifo_0 avalon_streaming sink
set_interface_property infifo_0 EXPORT_OF dc_infifo_0.in
add_interface led conduit end
set_interface_property led EXPORT_OF led.external_connection
add_interface memory conduit end
set_interface_property memory EXPORT_OF hps_0.memory
add_interface nmr_sys_pll_locked conduit end
set_interface_property nmr_sys_pll_locked EXPORT_OF nmr_sys_pll.locked
add_interface nmr_sys_pll_outclk clock source
set_interface_property nmr_sys_pll_outclk EXPORT_OF nmr_sys_pll.outclk0
add_interface nmr_sys_pll_reset reset sink
set_interface_property nmr_sys_pll_reset EXPORT_OF nmr_sys_pll.reset
add_interface outfifo_0 avalon_streaming source
set_interface_property outfifo_0 EXPORT_OF dc_outfifo_0.out
add_interface outfifo_1 avalon_streaming source
set_interface_property outfifo_1 EXPORT_OF dc_outfifo_1.out
add_interface pll_vga_clk65 clock source
set_interface_property pll_vga_clk65 EXPORT_OF gp_pll.outclk1
add_interface pll_vga_locked conduit end
set_interface_property pll_vga_locked EXPORT_OF gp_pll.locked
add_interface reset reset sink
set_interface_property reset EXPORT_OF clk_0.clk_in_reset
add_interface sdram_clk clock source
set_interface_property sdram_clk EXPORT_OF gp_pll.outclk3
add_interface sdram_wire conduit end
set_interface_property sdram_wire EXPORT_OF sdram.wire
add_interface switches conduit end
set_interface_property switches EXPORT_OF switches.external_connection

set_interconnect_requirement {$system} qsys_mm.clockCrossingAdapter HANDSHAKE
set_interconnect_requirement {$system} qsys_mm.maxAdditionalLatency 1

save_system soc_system.qsys
